# EAGLE design plugV15 (EAGLE 7.5.0)
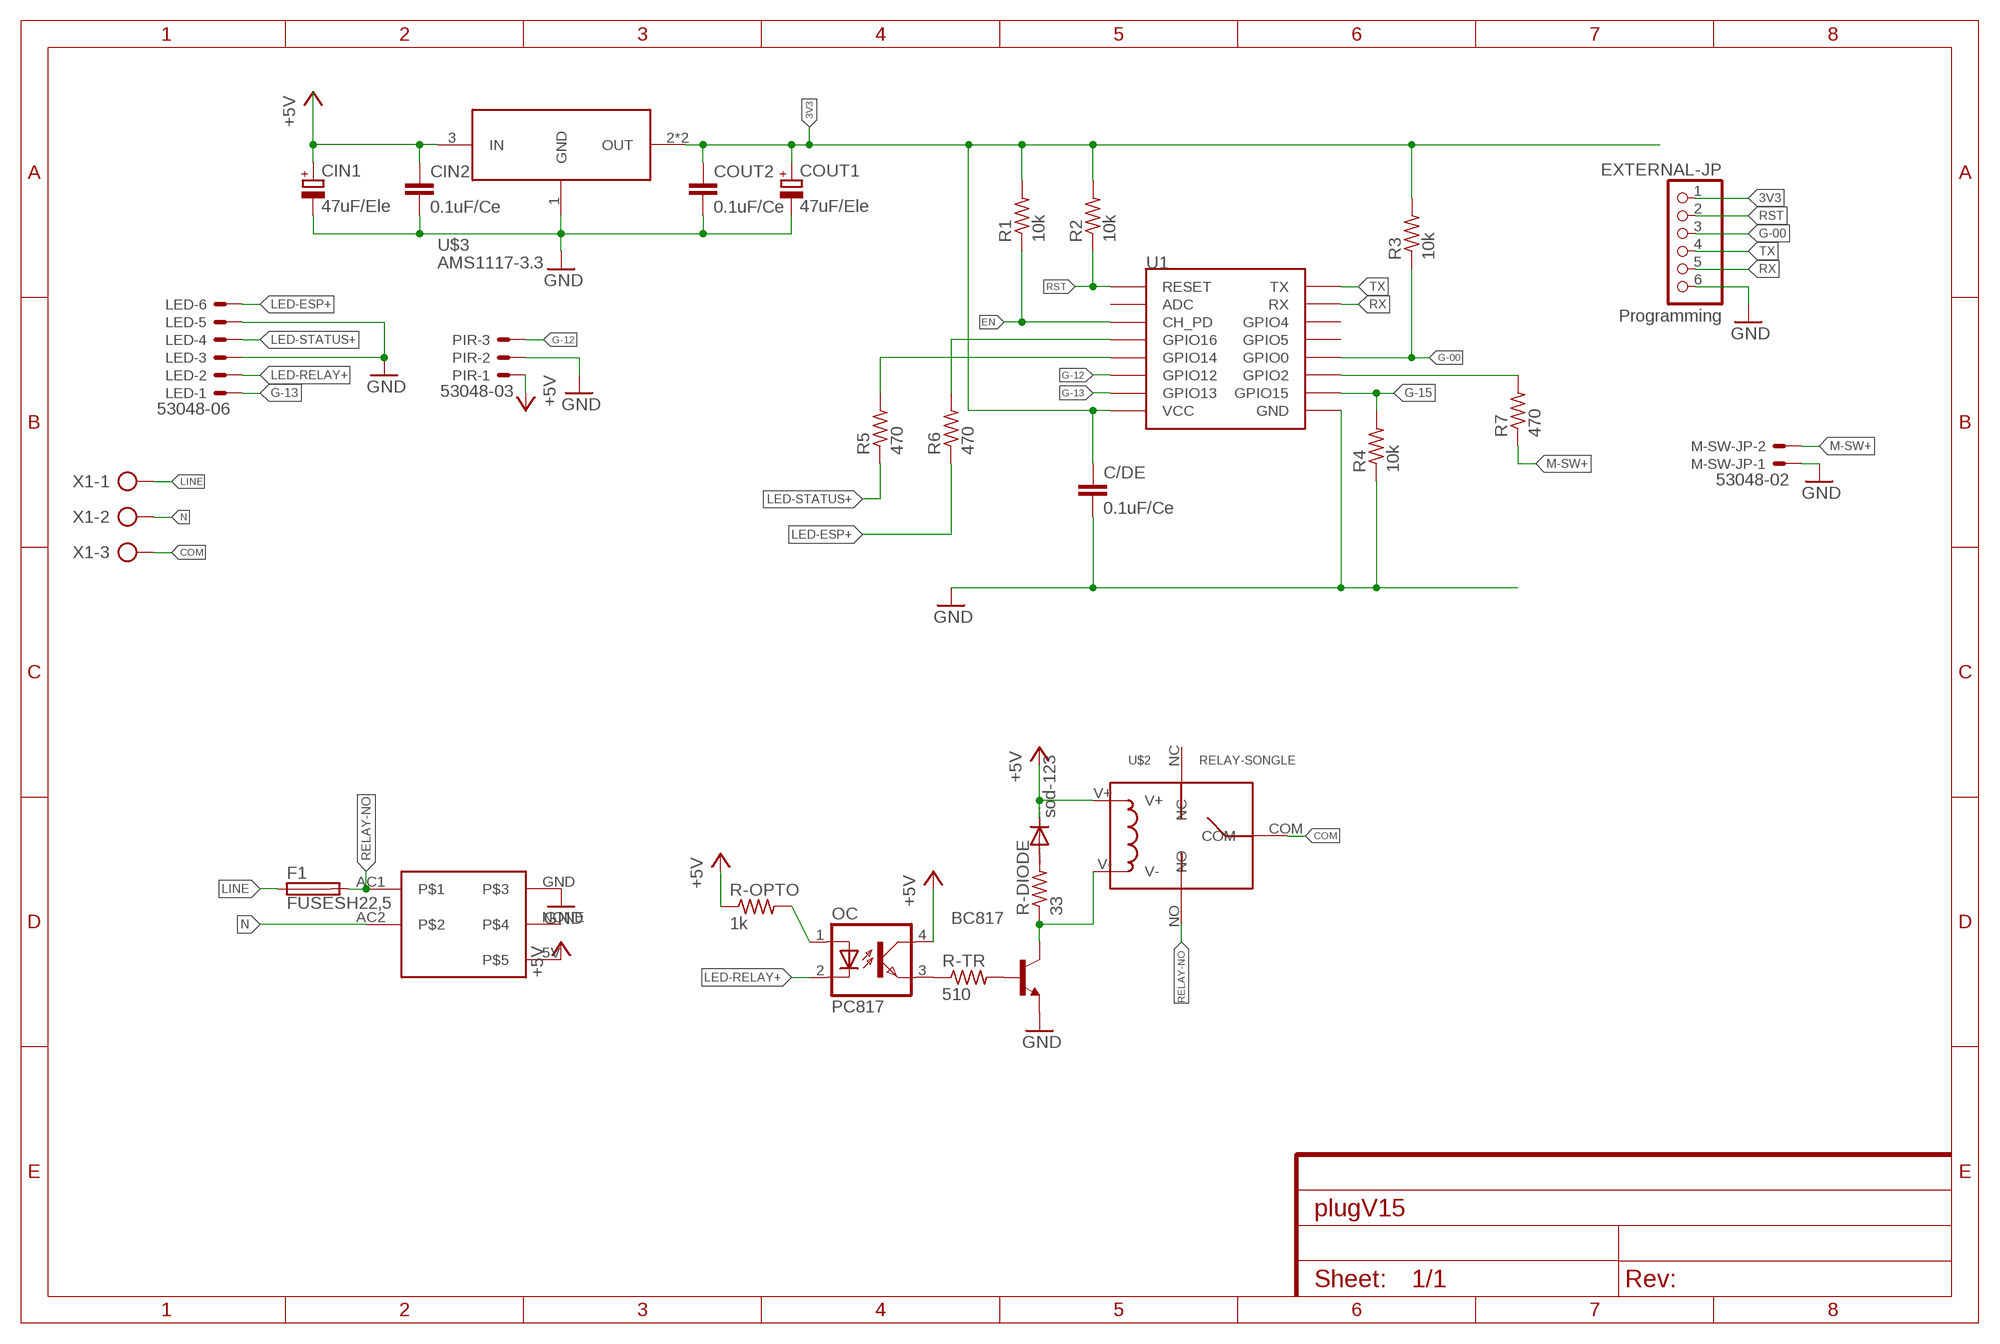
[diagram p0: schematic, sheet 1]

## Parts
1N4148  sod-123  CGRM4001-G  [SOD-123_MINI-SMA]
BC817  BC817-NPN-SOT23-BEC  [SOT23-BEC]
C/DE  0.1uF/Ce  C-EUC0805  [C0805]
CIN1  47uF/Ele  CPOL-EUE2-5  [E2-5]
CIN2  0.1uF/Ce  C-EUC0805  [C0805]
COUT1  47uF/Ele  CPOL-EUE2-5  [E2-5]
COUT2  0.1uF/Ce  C-EUC0805  [C0805]
EXTERNAL-JP  Programming  PINHD-1X6  [1X06]
F1  FUSESH22,5  [SH22,5]
LED  53048-06  [53048-06]
M-SW-JP  53048-02  [53048-02]
OC  PC817  [DIL04]
PIR  53048-03  [53048-03]
R1  10k  R-US_0207/10  [0207/10]
R2  10k  R-US_0207/10  [0207/10]
R3  10k  R-US_0207/10  [0207/10]
R4  10k  R-US_0207/10  [0207/10]
R5  470  R-US_0207/10  [0207/10]
R6  470  R-US_0207/10  [0207/10]
R7  470  R-US_0207/10  [0207/10]
R-DIODE  33  R-US_R0805  [R0805]
R-OPTO  1k  R-US_R0805  [R0805]
R-TR  510  R-US_R0805  [R0805]
U1  ESP12SMD  [ESP12-SMD]
U$2  RELAY-SONGLE  [RELAY-SONGLE]
U$3  AMS1117-3.3  [SOT-223]
U$4  POWERSUPPLY-5V-700MA  [POWERSUPPLY-5V-700MA]
X1  AK300/3  [AK300/3]

## Nets
3V3: C/DE.1 COUT1.+ COUT2.1 EXTERNAL-JP.1 R1.2 R2.2 R3.2 U1.VCC U$3.2(OUT) U$3.4(OUT)
+5V: 1N4148.C CIN1.+ CIN2.1 OC.4(COL) PIR.1 R-OPTO.1 U$2.V+ U$3.3(IN) U$4.5V
COM: U$2.COM X1.3
EN: R1.1 U1.CH_PD
G-00: EXTERNAL-JP.3 R3.1 U1.GPIO0
G-12: PIR.3 U1.GPIO12
G-13: LED.1 U1.GPIO13
G-15: R4.2 U1.GPIO15
GND: BC817.E C/DE.2 CIN1.- CIN2.2 COUT1.- COUT2.2 EXTERNAL-JP.6 LED.3 LED.5 M-SW-JP.1 PIR.2 R4.1 U1.GND U$3.1(GND) U$4.GND
LED-ESP+: LED.6 R6.1
LED-RELAY+: LED.2 OC.2(C)
LED-STATUS+: LED.4 R5.1
LINE: F1.1 X1.1
M-SW+: M-SW-JP.2 R7.1
N: U$4.AC2 X1.2
N$1: OC.3(EMIT) R-TR.1
N$2: BC817.B R-TR.2
N$4: R6.2 U1.GPIO16
N$7: R7.2 U1.GPIO2
N$8: R5.2 U1.GPIO14
N$13: OC.1(A) R-OPTO.2
N$16: 1N4148.A R-DIODE.2
N$17: BC817.C R-DIODE.1 U$2.V-
RELAY-NO: F1.2 U$2.NO U$4.AC1
RST: EXTERNAL-JP.2 R2.1 U1.RESET
RX: EXTERNAL-JP.5 U1.RXD0(RX)
TX: EXTERNAL-JP.4 U1.TXD0(TX)
Unconnected: U1.ADC U1.GPIO4 U1.GPIO5 U$2.NC U$4.NONE

## Library data of the parts
1N4148 = diode:CGRM400*-G: Molded plasitc,JEDEC SOD-123/Mini SMA Source: Comchip CGRM4001-G.pdf
BC817 = transistor-neu-to92:*-NPN-: NPN Transistror
C/DE CIN2 COUT2 = rcl:C-EU: CAPACITOR, European symbol
CIN1 COUT1 = rcl:CPOL-EU: POLARIZED CAPACITOR, European symbol
EXTERNAL-JP = pinhead:PINHD-1X6: PIN HEADER
F1 = fuse:FUSE: Fuse; OC_FARNELL: unknown; OC_NEWARK: unknown
LED = con-molex:53?-06: CONNECTOR wire to board 1.25 mm (.049 inch) pitch header; MF: WALDOM/MOLEX; MPN: 53048-0610; OC_FARNELL: 1012260; OC_NEWARK: 38C9911
M-SW-JP = con-molex:53?-02: CONNECTOR wire to board 1.25 mm (.049 inch) pitch header; MF: MOLEX; MPN: 53048-0210; OC_FARNELL: 1012259; OC_NEWARK: 57H4718
OC = optocoupler:PC817: SHARP OPTO COUPLER; MPN: PC817X4J000F; OC_FARNELL: 9707727; OC_NEWARK: 97K7059
PIR = con-molex:53?-03: CONNECTOR wire to board 1.25 mm (.049 inch) pitch header; MF: WALDOM/MOLEX; MPN: 53048-0310; OC_FARNELL: 9732918; OC_NEWARK: 38C9908
R1-R7 R-DIODE R-OPTO R-TR = rcl:R-US_: RESISTOR, American symbol
U1 = esp8266modules:ESP12: ESP8266 Wifi module 12
U$2 = Seeed-OPL-Relay:RELAY-SONGLE
U$3 = AMS1117-3.3:AMS1117-3.3: 1A LOW DROPOUT VOLTAGE REGULATOR
U$4 = PowerSupply-5V-700mA:POWERSUPPLY-5V-700MA
X1 = con-ptr500:AK300/3: CONNECTOR; OC_FARNELL: unknown; OC_NEWARK: unknown

## Board
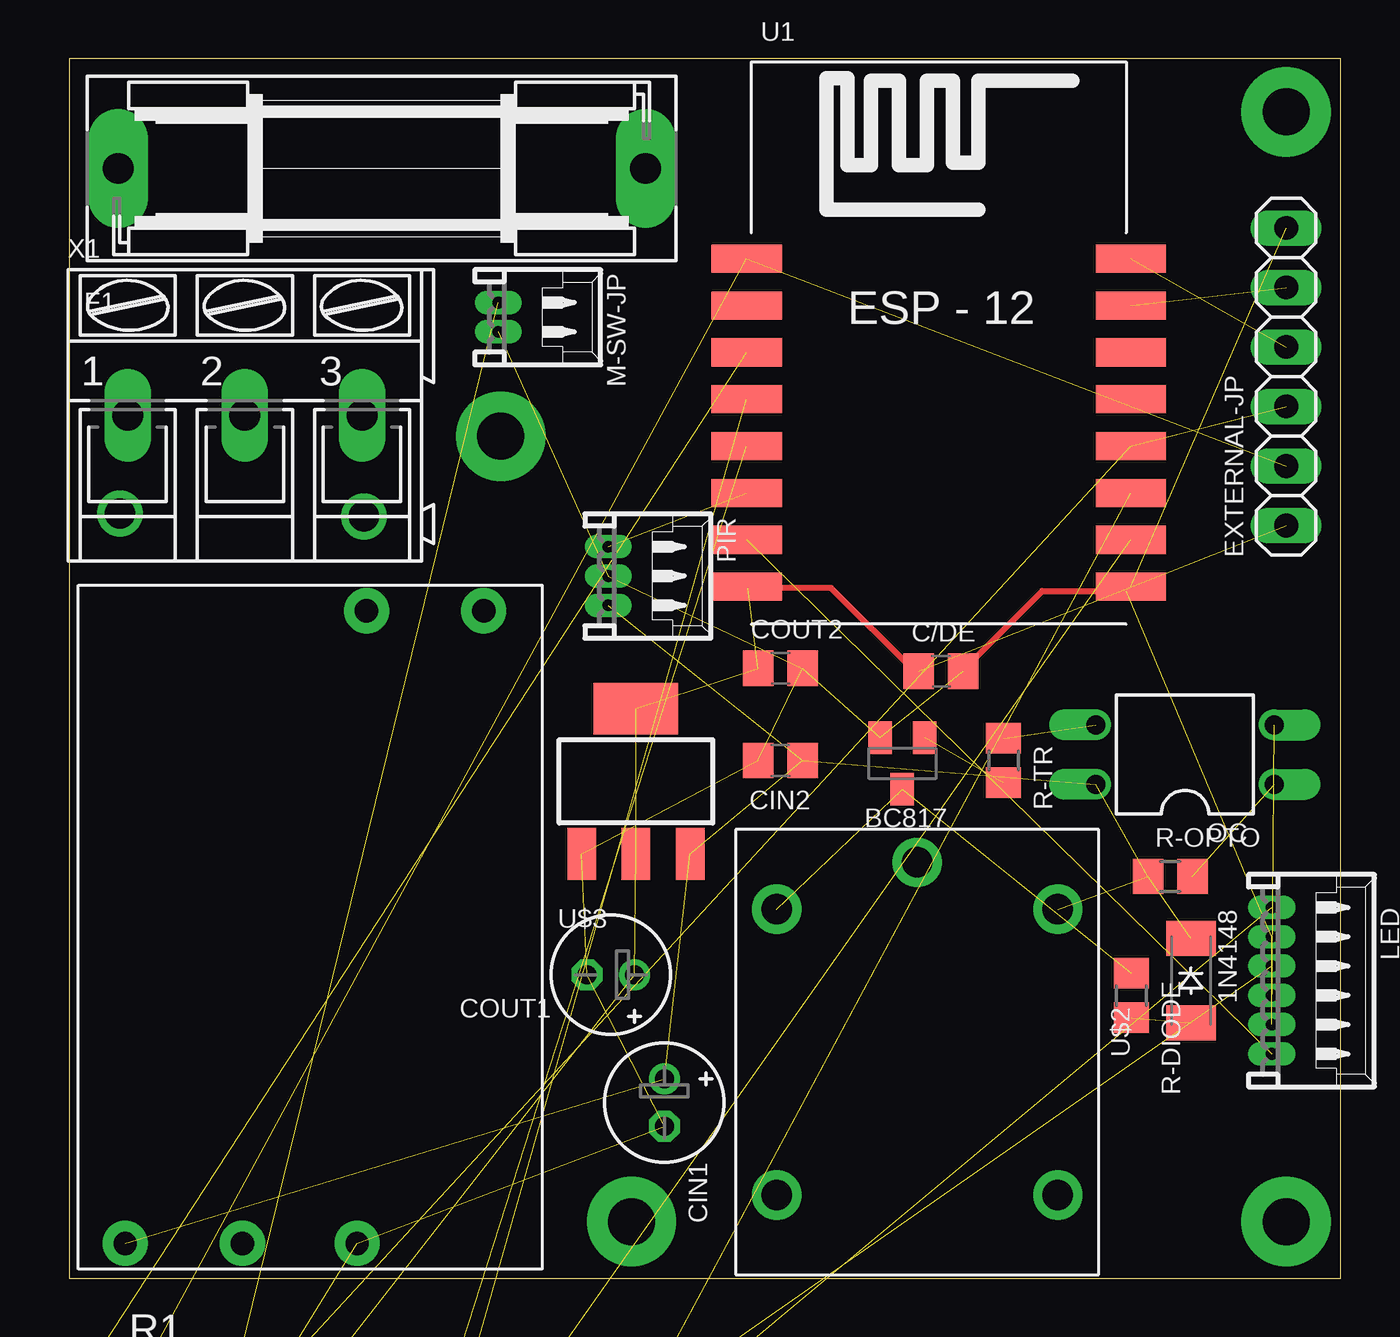
[diagram p1: board, top side]
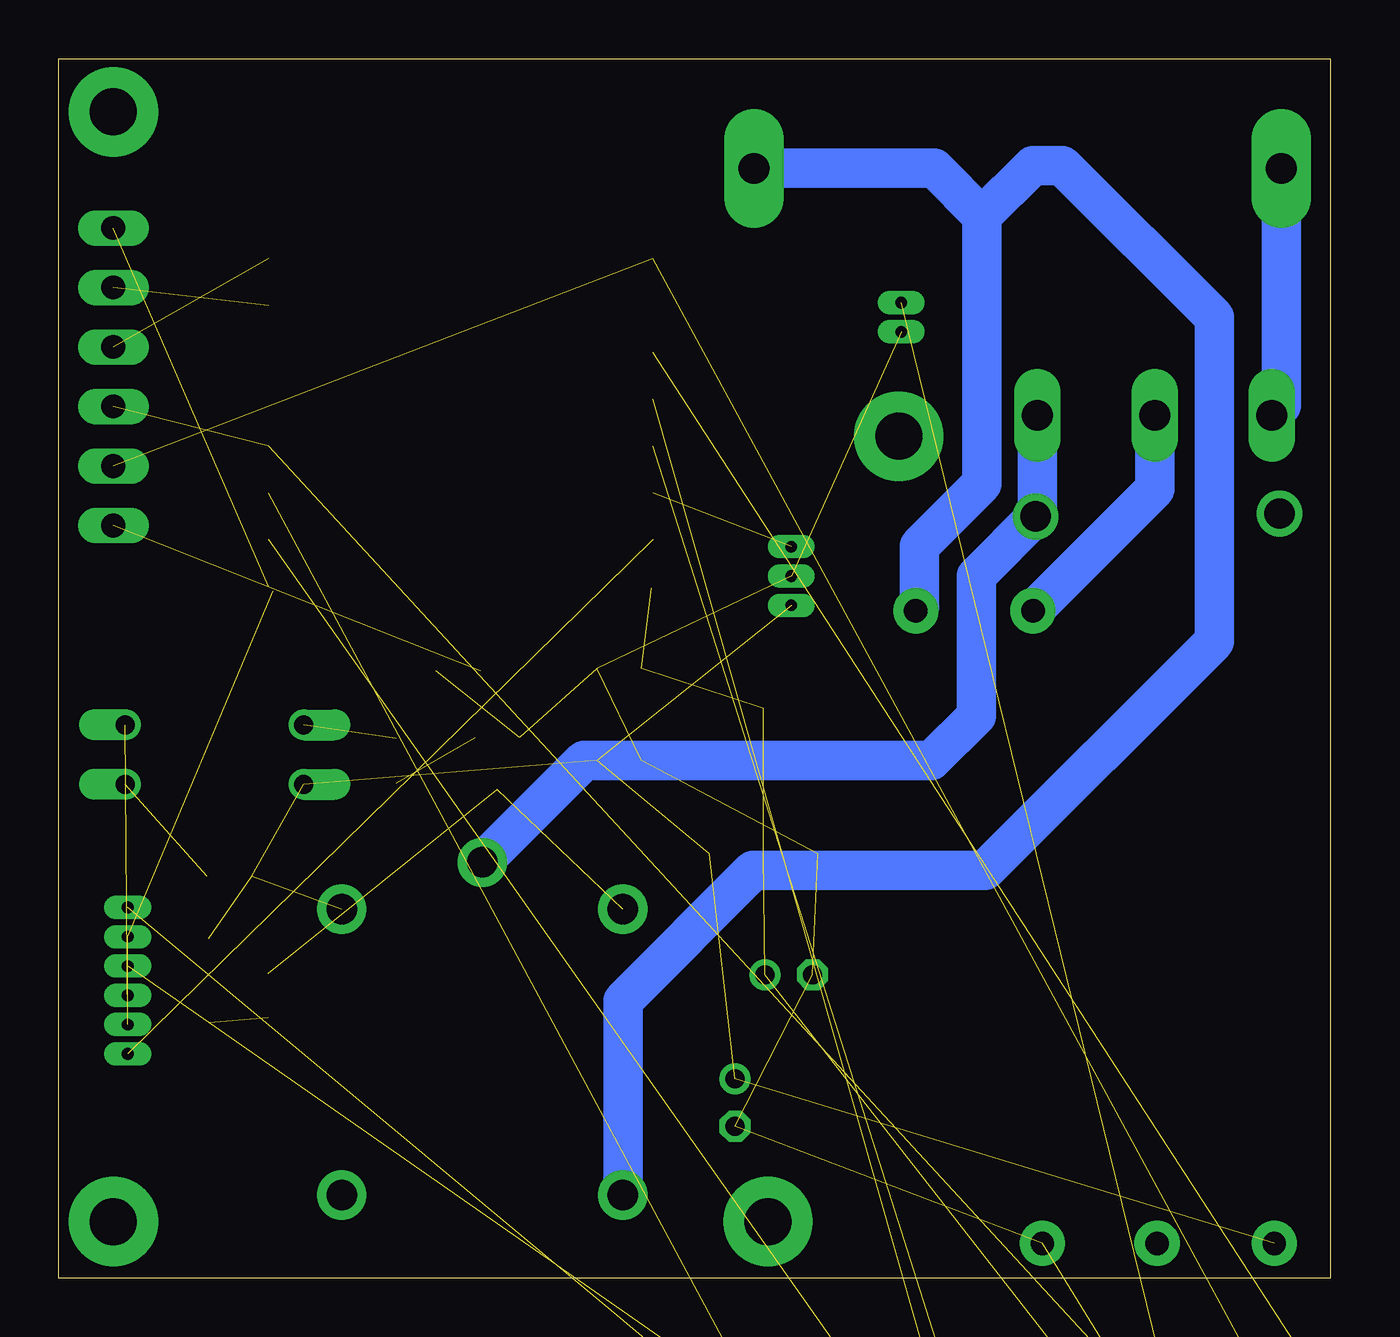
[diagram p2: board, bottom side, seen from below]

Size 54.28 x 52.06 mm. Coordinates in mm from the lower left corner, seen from the top.
Outline: 0,0 54.28,0 54.28,52.06 0,52.06 0,0
Copper layers (1*16): Top 0.035mm / dielectric 1.5mm / Bottom 0.035mm
Design rules "default": minimum track width 10mil, minimum drill 24mil, track to track 8mil, track to pad 8mil, pad to pad 8mil, via to via 8mil, smd to smd 8mil, copper to edge 40mil, drill to drill 8mil, minimum pad ring 10mil, minimum via ring 8mil, stop-mask expansion 4mil, vias tented up to drill 0mil, thermal gap 10mil

### Footprints (pad centres in the part's own frame; a part is rotated, then mirrored left to right if it is on the bottom)
SOD-123_MINI-SMA = smd 1.5 x 2.1: A 1.8,0; C -1.8,0
SOT23-BEC = smd 1 x 1.4: B -0.95,-1.1; C 0,1.1; E 0.95,-1.1
C0805 = smd 1.3 x 1.5: 1 -0.95,0; 2 0.95,0
E2-5 = drill 0.813 pad 1.27: + -1.016,0 | drill 0.813 pad 1.27 octagon: - 1.016,0
1X06 = drill 1.016 long: 1 -6.35,0; 2 -3.81,0; 3 -1.27,0; 4 1.27,0; 5 3.81,0; 6 6.35,0
SH22,5 = drill 1.321 pad 2.54 long: 1 -11.252,0; 2 11.252,0
53048-06 = drill 0.5 pad 0.698 long: 1 3.125,-1.25; 2 1.875,-1.25; 3 0.625,-1.25; 4 -0.625,-1.25; 5 -1.875,-1.25; 6 -3.125,-1.25
53048-02 = drill 0.5 pad 0.698 long: 1 0.625,-1.25; 2 -0.625,-1.25
DIL04 = drill 0.813 offset: 1 -1.27,-3.81; 2 1.27,-3.81; 3 1.27,3.81; 4 -1.27,3.81
53048-03 = drill 0.5 pad 0.698 long: 1 1.25,-1.25; 2 0,-1.25; 3 -1.25,-1.25
0207/10 = drill 0.813 octagon: 1 -5.08,0; 2 5.08,0
R0805 = smd 1.3 x 1.5: 1 -0.95,0; 2 0.95,0
ESP12-SMD = smd 3 x 1.2: ADC -8.3,3.8; CH_PD -8.3,1.8; GND 8.1,-8.2; GPIO0 8.1,-2.2; GPIO2 8.1,-4.2; GPIO4 8.1,1.8; GPIO5 8.1,-0.2; GPIO12 -8.3,-4.2; GPIO13 -8.3,-6.2; GPIO14 -8.3,-2.2; GPIO15 8.1,-6.2; GPIO16 -8.3,-0.2; RESET -8.3,5.8; RXD0 8.1,3.8; TXD0 8.1,5.8; VCC -8.3,-8.2
RELAY-SONGLE = drill 1.3 pad 2.1: COM -8.1,0; NC 6.1,6; NO 6.1,-6; V+ -6.1,6; V- -6.1,-6
SOT-223 = smd 1.219 x 2.235: 1 -2.381,-3.099; 2 -0.07,-3.099; 3 2.241,-3.099 | smd 3.6 x 2.2: 4 -0.07,3.099
POWERSUPPLY-5V-700MA = drill 1 pad 1.93: 5V 13.5,-7.9; AC1 -13.5,7.4; AC2 -13.5,2.4; GND 13.5,2; NONE 13.5,-2.9
AK300/3 = drill 1.321 long: 1 -5.004,0; 2 0,0; 3 5.004,0

### Placement (x,y rotation side)
1N4148  47.88,12.7 270 top
BC817  35.56,21.97 180 top
C/DE  37.21,25.91 0 top
CIN1  25.4,7.49 270 top
CIN2  30.35,22.1 180 top
COUT1  23.11,12.95 180 top
COUT2  30.35,26.04 0 top
EXTERNAL-JP  51.94,38.48 90 top
F1  13.34,47.37 0 top
LED  52.58,12.7 270 top
M-SW-JP  19.56,41.02 270 top
OC  47.62,22.35 90 top
PIR  24.26,29.97 270 top
R1  5.59,-4.32 0 top  (outside the outline)
R2  5.59,-8.76 0 top  (outside the outline)
R3  5.59,-13.21 0 top  (outside the outline)
R4  5.59,-17.65 0 top  (outside the outline)
R5  5.59,-22.1 0 top  (outside the outline)
R6  5.59,-26.54 0 top  (outside the outline)
R7  5.59,-30.99 0 top  (outside the outline)
R-DIODE  45.34,12.06 270 top
R-OPTO  46.99,17.14 0 top
R-TR  39.88,22.1 270 top
U1  37.21,37.72 0 top
U$2  36.2,9.65 270 top
U$3  24.26,21.21 0 top
U$4  10.29,14.99 270 top
X1  7.49,36.83 0 top

### Tracks (layer width: path | path; a pad name or v marks a point on that pad's centre or on a via)
3V3  (8 unrouted)
  Top 0.254: C/DE.1 36.07,25.91 32.51,29.46 28.97,29.46 U1.VCC
+5V  (8 unrouted)
COM
  Bottom 1.676: X1.3 12.5,32.59 15.11,29.97 15.11,24 17.02,22.1 31.85,22.1 U$2.COM
EN  (1 unrouted)
G-00  (2 unrouted)
G-12  (1 unrouted)
G-13  (1 unrouted)
G-15  (1 unrouted)
GND  (13 unrouted)
  Top 0.254: C/DE.2 38.16,25.97 41.53,29.34 45.13,29.34 U1.GND
LED-ESP+  (1 unrouted)
LED-RELAY+  (1 unrouted)
LED-STATUS+  (1 unrouted)
LINE
  Bottom 1.676: F1.1 2.08,37.24 X1.1
M-SW+  (1 unrouted)
N
  Bottom 1.676: X1.2 7.49,33.68 U$4.AC2
N$1  (1 unrouted)
N$2  (1 unrouted)
N$3  (via drill 2 pad 3.81)
  other vias: 18.41,35.94
N$4  (1 unrouted)
N$5  (via drill 2 pad 3.81)
  other vias: 24,2.41
N$6  (via drill 2 pad 3.81)
  other vias: 51.94,2.41
N$7  (1 unrouted)
N$8  (1 unrouted)
N$9  (via drill 2 pad 3.81)
  other vias: 51.94,49.78
N$13  (1 unrouted)
N$16  (1 unrouted)
N$17  (2 unrouted)
N$19  (via drill 1.3)
  other vias: 2.16,32.64
N$20  (via drill 1.3)
  other vias: 12.57,32.51
RELAY-NO
  Bottom 1.676: F1.2 16.89,47.37 14.86,45.34 | 14.86,45.34 14.86,33.91 17.53,31.24 17.53,28.65 U$4.AC1 | U$2.NO 30.2,11.84 24.64,17.4 14.73,17.4 4.95,27.18 4.95,41.02 11.43,47.5 12.7,47.5 14.86,45.34
RST  (2 unrouted)
RX  (1 unrouted)
TX  (1 unrouted)